# Altium schematic sheet FlexEMG_v0r0_POWER-SUPPLIES.SchDoc
size A
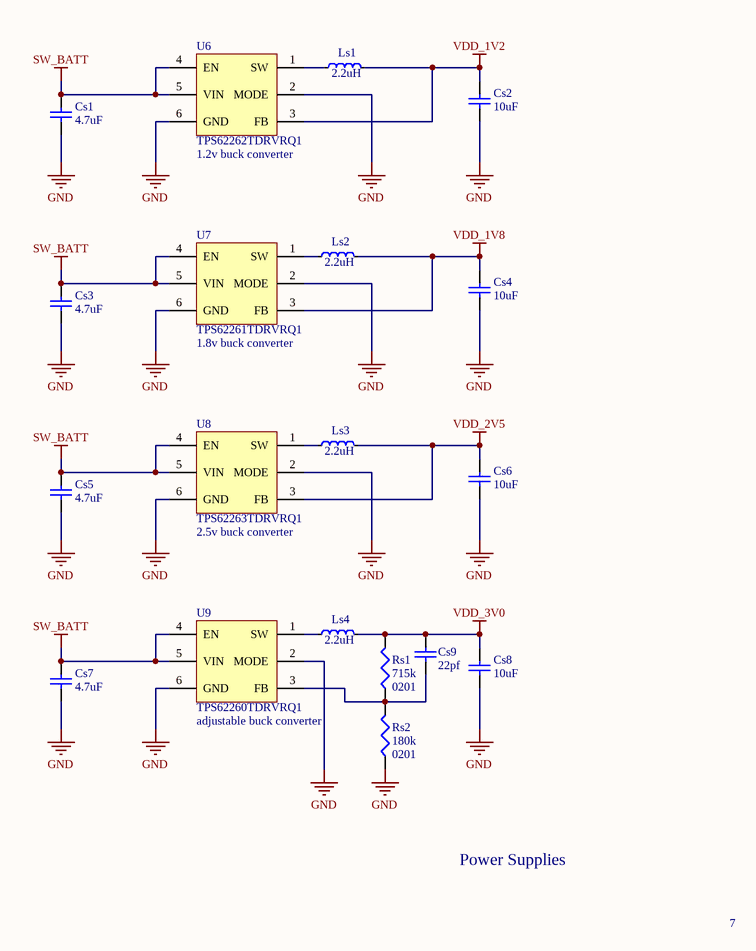
[diagram p0: FlexEMG_v0r0_POWER-SUPPLIES.SchDoc]

## Parts
Cs1  value 4.7uF  [c0603-Murata-GR]  (hidden comment: GRM188R6YA475KE15D)
Cs2  value 10uF  [c0603-Murata-GR]  (hidden comment: GRM188R61E106MA73D)
Cs3  value 4.7uF  [c0603-Murata-GR]  (hidden comment: GRM188R6YA475KE15D)
Cs4  value 10uF  [c0603-Murata-GR]  (hidden comment: GRM188R61E106MA73D)
Cs5  value 4.7uF  [c0603-Murata-GR]  (hidden comment: GRM188R6YA475KE15D)
Cs6  value 10uF  [c0603-Murata-GR]  (hidden comment: GRM188R61E106MA73D)
Cs7  value 4.7uF  [c0603-Murata-GR]  (hidden comment: GRM188R6YA475KE15D)
Cs8  value 10uF  [c0603-Murata-GR]  (hidden comment: GRM188R61E106MA73D)
Cs9  value 22pf  [c0402-Murata-GR]  (hidden comment: GRM1555C1H220FA01D)
Ls1  value 2.2uH  [LEAD_REGULATOR]
Ls2  value 2.2uH  [LEAD_REGULATOR]
Ls3  value 2.2uH  [LEAD_REGULATOR]
Ls4  value 2.2uH  [LEAD_REGULATOR]
Rs1  value 715k  Package: 0201  [0201_p]  (hidden comment: ERJ-1GEF7153C)
Rs2  value 180k  Package: 0201  [0201_p]  (hidden comment: ERJ-1GEF1803C)
U6  TPS62262TDRVRQ1  Note: 1.2v buck converter  [TPS_PACKAGE_novia]
U7  TPS62261TDRVRQ1  Note: 1.8v buck converter  [TPS_PACKAGE_novia]
U8  TPS62263TDRVRQ1  Note: 2.5v buck converter  [TPS_PACKAGE_novia]
U9  TPS62260TDRVRQ1  Note: adjustable buck converter  [TPS_PACKAGE_novia]

## Nets
GND: Cs1.1 Cs2.1 Cs3.1 Cs4.1 Cs5.1 Cs6.1 Cs7.1 Cs8.1 Rs2.1 U6.2(MODE) U6.6(GND) U6.7(GND) U7.2(MODE) U7.6(GND) U7.7(GND) U8.2(MODE) U8.6(GND) U8.7(GND) U9.2(MODE) U9.6(GND) U9.7(GND)
SW_BATT: Cs1.2 Cs3.2 Cs5.2 Cs7.2 U6.4(EN) U6.5(VIN) U7.4(EN) U7.5(VIN) U8.4(EN) U8.5(VIN) U9.4(EN) U9.5(VIN)
VDD_1V2: Cs2.2 Ls1.1 U6.3(FB)
VDD_1V8: Cs4.2 Ls2.1 U7.3(FB)
VDD_2V5: Cs6.2 Ls3.1 U8.3(FB)
VDD_3V0: Cs8.2 Cs9.2 Ls4.1 Rs1.2
NetCs9_1: Cs9.1 Rs1.1 Rs2.2 U9.3(FB)
NetLs1_2: Ls1.2 U6.1(SW)
NetLs2_2: Ls2.2 U7.1(SW)
NetLs3_2: Ls3.2 U8.1(SW)
NetLs4_2: Ls4.2 U9.1(SW)

## Notes on the sheet
- Power Supplies
- 7

## Library data of the parts
Cs1 Cs3 Cs5 Cs7 = Cap: CAP CER 4.7UF 35V X5R 0603; Manufacturer: Murata; Supplier: Digikey; Supplier PN: 490-7205-1-ND; Manufacturer PN: GRM188R6YA475KE15D
Cs2 Cs4 Cs6 Cs8 = Cap: CAP CER 10UF 25V X5R 0603 20%; Manufacturer: Murata; Supplier: Digikey; Supplier PN: 490-7202-1-ND; Manufacturer PN: GRM188R61E106MA73D
Cs9 = Cap: CAP CER 22PF 50V NP0 0402; Manufacturer: Murata; Supplier: Digikey; Supplier PN: 490-8589-1-ND; Manufacturer PN: GRM1555C1H220FA01D
Ls1-Ls4 = LEAD_REGUALTOR: FIXED IND 2.2UH 1A 120 MOHM SMD; Manufacturer PN: LQM2HPN2R2MJ0L; Manufacturer: Murata; Supplier PN: 490-6700-6-ND; Supplier: Digikey
Rs1 = Resistor: RES SMD 715K OHM 1% 1/20W 0201; Manufacturer: Panasonic; Manufacturer PN: ERJ-1GEF7153C; Supplier: Digikey; Supplier P/N: P715KABCT-ND; Power: 1/20W
Rs2 = Resistor: RES SMD 180K OHM 1% 1/20W 0201; Manufacturer: Panasonic; Manufacturer PN: ERJ-1GEF1803C; Supplier: Digikey; Supplier P/N: P180KABCT-ND; Power: 1/20W
U6 = TPS62262: IC REG BUCK 1.2V 0.6A SYNC 6SON; Manufacturer: TI; Supplier: Digikey; Supplier PN: 296-25730-1-ND; Manufacturer PN: TPS62262TDRVRQ1
U7 = TPS62261: IC REG BUCK 1.8V 0.6A SYNC 6SON; Manufacturer: TI; Supplier PN: 296-25729-1-ND; Supplier: Digikey; Manufacturer PN: TPS62261TDRVRQ1
U8 = TPS62263: IC REG BUCK 2.5V 0.6A SYNC 6SON; Manufacturer: TI; Supplier: Digikey; Supplier PN: 296-25731-1-ND; Manufacturer PN: TPS62263TDRVRQ1
U9 = TPS62260DRVR: IC REG BUCK ADJ 0.6A SYNC 6SON; Manufacturer: TI; Supplier PN: 296-36823-1-ND; Supplier: Digikey; Manufacturer PN: TPS62260TDRVRQ1